# EAGLE schematic ArduinoInterface_v5 (EAGLE 9.2.1)
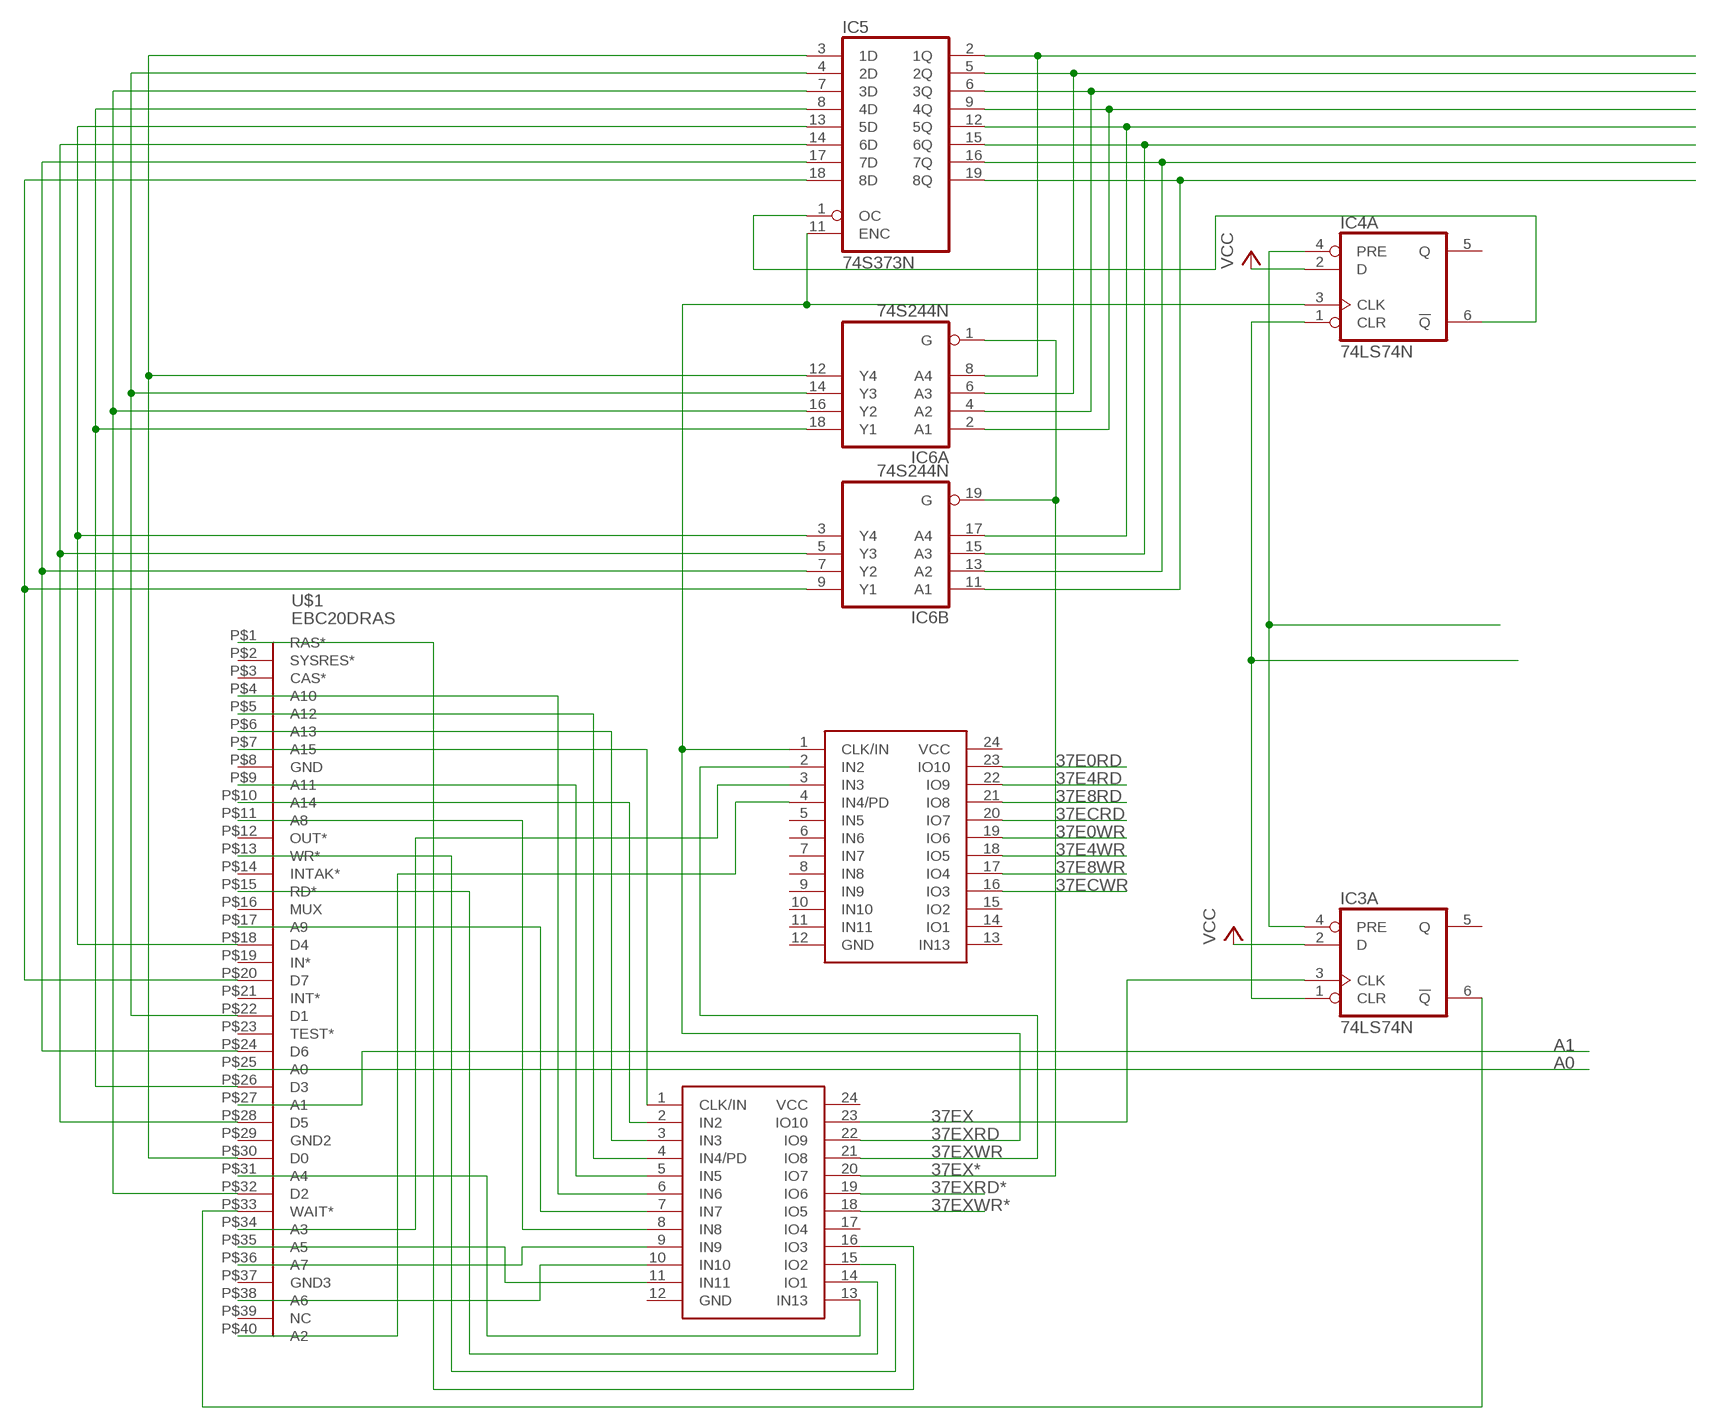
[diagram p0: schematic, sheet 1]

## Parts
IC1  ATF22V10C  [DIP24SKI]
IC2  ATF22V10C  [DIP24SKI]
IC3  74LS74N  [DIL14]
IC4  74LS74N  [DIL14]
IC5  74S373N  [DIL20]
IC6  74S244N  [DIL20]
U$1  EBC20DRAS  [EBC20DRAS]

## Nets
37E0RD: IC2.23(IO10)
37E0WR: IC2.19(IO6)
37E4RD: IC2.22(IO9)
37E4WR: IC2.18(IO5)
37E8RD: IC2.21(IO8)
37E8WR: IC2.17(IO4)
37ECRD: IC2.20(IO7)
37ECWR: IC2.16(IO3)
37EX: IC1.23(IO10) IC3.3(A:CLK)
37EX*: IC1.20(IO7) IC6.1(A:G) IC6.19(B:G)
37EXRD: IC1.22(IO9) IC2.1(CLK/IN) IC4.3(A:CLK) IC5.11(ENC)
37EXRD*: IC1.19(IO6)
37EXWR: IC1.21(IO8) IC2.2(IN2)
37EXWR*: IC1.18(IO5)
A0: U$1.P$25(A0)
A1: U$1.P$27(A1)
D0: IC5.3(1D) IC6.12(A:Y4) U$1.P$30(D0)
D1: IC5.4(2D) IC6.14(A:Y3) U$1.P$22(D1)
D2: IC5.7(3D) IC6.16(A:Y2) U$1.P$32(D2)
D3: IC5.8(4D) IC6.18(A:Y1) U$1.P$26(D3)
D4: IC5.13(5D) IC6.3(B:Y4) U$1.P$18(D4)
D5: IC5.14(6D) IC6.5(B:Y3) U$1.P$28(D5)
D6: IC5.17(7D) IC6.7(B:Y2) U$1.P$24(D6)
D7: IC5.18(8D) IC6.9(B:Y1) U$1.P$20(D7)
N$1: IC1.1(CLK/IN) U$1.P$7(A15)
N$2: IC1.2(IN2) U$1.P$10(A14)
N$3: IC1.3(IN3) U$1.P$6(A13)
N$4: IC1.4(IN4/PD) U$1.P$5(A12)
N$5: IC1.5(IN5) U$1.P$9(A11)
N$6: IC1.6(IN6) U$1.P$4(A10)
N$7: IC1.7(IN7) U$1.P$17(A9)
N$8: IC1.8(IN8) U$1.P$11(A8)
N$9: IC1.9(IN9) U$1.P$36(A7)
N$10: IC1.10(IN10) U$1.P$38(A6)
N$11: IC1.11(IN11) U$1.P$35(A5)
N$12: IC1.13(IN13) U$1.P$31(A4)
N$13: IC1.14(IO1) U$1.P$15(RD*)
N$14: IC1.15(IO2) U$1.P$13(WR*)
N$15: IC1.16(IO3) U$1.P$1(RAS*)
N$16: IC2.3(IN3) U$1.P$34(A3)
N$17: IC2.4(IN4/PD) U$1.P$40(A2)
N$18: IC5.2(1Q) IC6.8(A:A4)
N$19: IC3.6(A:!Q) U$1.P$33(WAIT*)
N$20: IC3.4(A:PRE) IC4.4(A:PRE)
N$21: IC3.1(A:CLR) IC4.1(A:CLR)
N$22: IC4.6(A:!Q) IC5.1(OC)
N$31: IC5.5(2Q) IC6.6(A:A3)
N$32: IC5.6(3Q) IC6.4(A:A2)
N$33: IC5.9(4Q) IC6.2(A:A1)
N$34: IC5.12(5Q) IC6.17(B:A4)
N$35: IC5.15(6Q) IC6.15(B:A3)
N$36: IC5.16(7Q) IC6.13(B:A2)
N$37: IC5.19(8Q) IC6.11(B:A1)
VCC: IC3.2(A:D) IC4.2(A:D)
Unconnected: IC1.12(GND) IC1.17(IO4) IC1.24(VCC) IC2.5(IN5) IC2.6(IN6) IC2.7(IN7) IC2.8(IN8) IC2.9(IN9) IC2.10(IN10) IC2.11(IN11) IC2.12(GND) IC2.13(IN13) IC2.14(IO1) IC2.15(IO2) IC2.24(VCC) IC3.5(A:Q) IC3.8(B:!Q) IC3.9(B:Q) IC3.10(B:PRE) IC3.11(B:CLK) IC3.12(B:D) IC3.13(B:CLR) IC4.5(A:Q) IC4.8(B:!Q) IC4.9(B:Q) IC4.10(B:PRE) IC4.11(B:CLK) IC4.12(B:D) IC4.13(B:CLR) U$1.P$2(SYSRES*) U$1.P$3(CAS*) U$1.P$8(GND) U$1.P$12(OUT*) U$1.P$14(INTAK*) U$1.P$16(MUX) U$1.P$19(IN*) U$1.P$21(INT*) U$1.P$23(TEST*) U$1.P$29(GND2) U$1.P$37(GND3) U$1.P$39(NC)

## Power pins joined to a net without a drawn wire
GND: IC3.7(P:GND) IC4.7(P:GND) IC5.10(GND) IC6.10(P:GND)
VCC: IC3.14(P:VCC) IC4.14(P:VCC) IC5.20(VCC) IC6.20(P:VCC)

## Library data of the parts
IC1 IC2 = cpld:ATF22V10C: ATF22V10 - programmable logic device
IC3 IC4 = 74xx-eu:74*74: Dual D type positive edge triggered FLIP FLOP, preset and clear
IC5 = 74xx-us:74*373: Octal D type transparent LATCH, edge triggered
IC6 = 74xx-us:74*244: Octal BUFFER and LINE DRIVER, 3-state
U$1 = TMS99:EBC20DRAS